# Altium project Second_plate_pic.PrjPcb
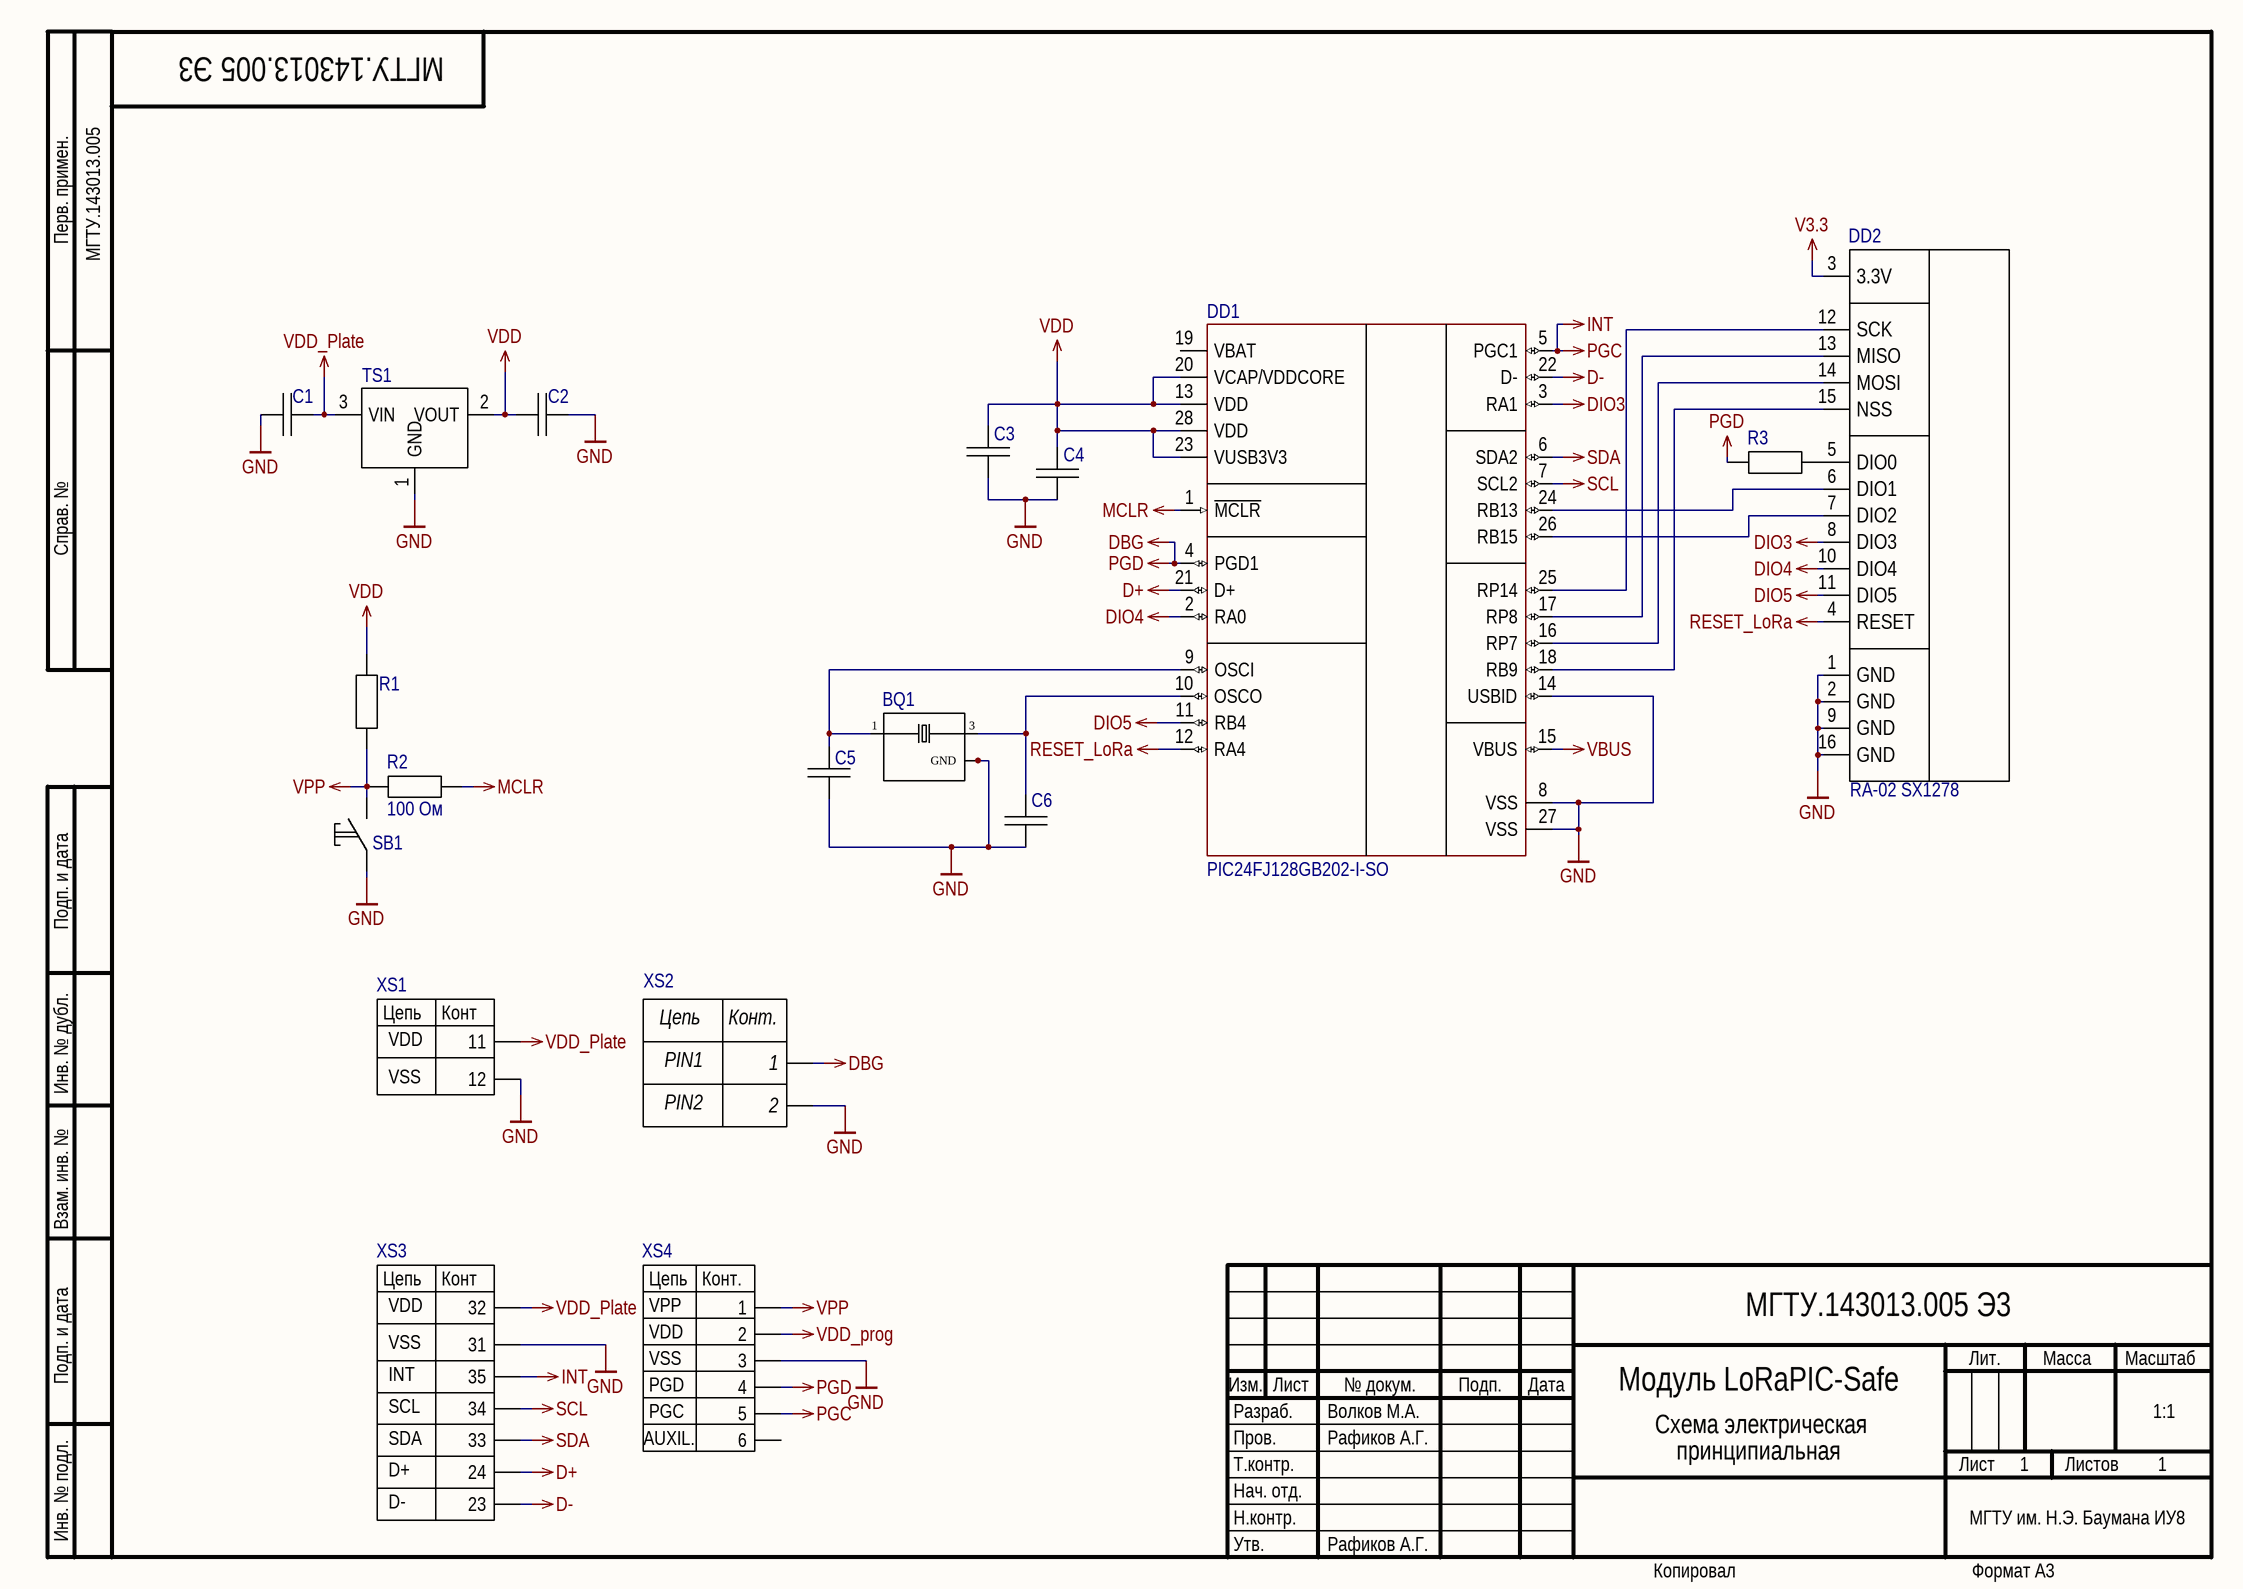
[diagram p0: LoraPic2.SchDoc]
1 sheet, 18 parts. Net scope: global (net labels, ports and power ports of the same name join across sheets).
Board file: LoraPIC2.PcbDoc

## Sheet LoraPic2.SchDoc
size 420 x 297 mm; Organization: Altium Limited; Address1: L3, 12a Rodborough Rd; Address2: Frenchs Forest; Address3: NSW; Address4: Australia 2086; Scale: 1:1; Разраб.: Волков М.А.; Обозначение документа: МГТУ.143013.005 Э3; Пров.: Рафиков А.Г.; Утв.: Рафиков А.Г.; Номер листа: 1; Общее количество листов: 1; Масштаб: 1:1; Наименование организации: МГТУ им. Н.Э. Баумана ИУ8; Перв. применение: МГТУ.143013.005; Наименование изделия 1: Модуль LoRaPIC-Safe; Наименование изделия 2: Схема электрическая; Наименование изделия 3: принципиальная; Нач. отд.: Нач. отд.

### Parts
BQ1  NX2520SA  [*XTAL_NX2520SA-24.000000MHZ-B8]  (value not drawn)
C1  *  [CAPC1608X09L]  (value not drawn)
C2  *  [CAPC1608X09L]  (value not drawn)
C3  *  [CAPC1608X09L]  (value not drawn)
C4  *  [CAPC1608X09L]  (value not drawn)
C5  GRM1885C1H510JA01D  [CAPC1608X09L]  (value not drawn)
C6  GRM1885C2A150JA01D  [CAPC1608X09L]  (value not drawn)
DD1  PIC24FJ128GB202-I-SO  [Microchip_SO-28_0]
DD2  RA-02 SX1278  [RA-02]
R1  RC0603FR-0710KL  [RESC1608X05N]  (value not drawn)
R2  value 100 Ом  [RESC1608X05N]  (hidden comment: 100 ом до 470)
R3  100 ом до 470  [RESC1608X05N]  (value not drawn)
SB1  1437566-3 (FSMSM)  [*SW_1437566-4]  (value not drawn)
TS1  LD1117S33CTR  [*SOT223]  (value not drawn)
XS1  PBS-20  [PBS-20 - 13]  (value not drawn)
XS2  DS1066-02M(MW-2M)  [B2B-XH-A]  (value not drawn)
XS3  PBS-20  [PBS-20]  (value not drawn)
XS4  DS1021-2x3S  [DS1021-2x3S]  (value not drawn)

### Nets
D+: DD1.21(D+) XS3.17(24)
D-: DD1.22(D-) XS3.18(23)
DBG: DD1.4(PGD1) R3.2 XS2.1 XS4.4  [also labelled PGD]
DIO3: DD1.3(RA1) DD2.8(DIO3)
DIO4: DD1.2(RA0) DD2.10(DIO4)
DIO5: DD1.11(RB4) DD2.11(DIO5)
GND: BQ1.2(GND) BQ1.4(GND) C1.2 C2.1 C3.2 C4.2 C5.2 C6.2 DD1.8(VSS) DD1.14(USBID) DD1.27(VSS) DD2.1(GND) DD2.2(GND) DD2.9(GND) DD2.16(GND) SB1.1 TS1.1(GND) XS1.12 XS2.2 XS3.10(31) XS4.3
INT: DD1.5(PGC1) XS3.6(35) XS4.5  [also labelled PGC]
MCLR: DD1.1(~{MCLR}) R2.1
RESET_LoRa: DD1.12(RA4) DD2.4(RESET)
SCL: DD1.7(SCL2) XS3.7(34)
SDA: DD1.6(SDA2) XS3.8(33)
V3.3: DD2.3(3.3V)
VBUS: DD1.15(VBUS)
VDD: C2.2 C3.1 C4.1 DD1.13(VDD) DD1.20(VCAP/VDDCORE) DD1.23(VUSB3V3) DD1.28(VDD) R1.1 TS1.2(VOUT)
VDD_Plate: C1.1 TS1.3(VIN) XS1.11 XS3.9(32)
VDD_prog: XS4.2
VPP: R1.2 R2.2 SB1.2 XS4.1
NetBQ1_1: BQ1.1 C5.1 DD1.9(OSCI)
NetBQ1_3: BQ1.3 C6.1 DD1.10(OSCO)
NetDD1_16: DD1.16(RP7) DD2.14(MOSI)
NetDD1_17: DD1.17(RP8) DD2.13(MISO)
NetDD1_18: DD1.18(RB9) DD2.15(NSS)
NetDD1_24: DD1.24(RB13) DD2.6(DIO1)
NetDD1_25: DD1.25(RP14) DD2.12(SCK)
NetDD1_26: DD1.26(RB15) DD2.7(DIO2)
NetDD2_5: DD2.5(DIO0) R3.1

Not connected (* = marked no-connect by the designer): DD1 19(VBAT); XS4 6

### Notes on the sheet
- Перв. примен.
- Справ. №
- Подп. и дата
- Инв. № дубл.
- Взам. инв. №
- Разраб.
- Изм.
- Лист
- № докум.
- Подп.
- Дата
- Лит.
- Масса
- Масштаб
- Пров.
- Т.контр.
- Листов
- Инв. № подл.
- Утв.
- Н.контр.
- Копировал
- Формат А3
- (in symbol B2B-XH-A) Цепь; Конт.; PIN1; PIN2
- (in symbol PBS-20_1) Цепь; Конт; VDD; VSS
- (in symbol PBS_20_2) Цепь; Конт; VDD; VSS; INT; SCL; SDA; D+; D-
- (in symbol PLD3X2) Цепь; Конт.; VPP; VDD; VSS; PGD; PGC; AUXIL.

### Library data of the parts
BQ1 = NX2520SA-24.000000MHZ-B8: CRYSTAL 24.0000MHZ 10PF SMD; MF: NDK America, Inc.; Package: SMD-4 NDK America, Inc.; MP: NX2520SA-24.000000MHZ-B8; Availability: Unavailable; SnapEDA_Link: https://www.snapeda.com/parts/NX2520SA-24.000000MHZ-B8/NDK%20America%2C%20Inc./view-part/?ref=snap; Price: None; Value: *
C1 = CC1608: Конденсатор 1.6x0.8 мм; Tolerance: ±10%; ТКЕ: X7R; РКД Наименование: CC1608M - NP0 - 16 V - 10 nF ±10%; GRM21BR71C105KA01L: 100n; Voltage: *; Type: *; PartNo: *; Supplier Part Number 1: *; Supplier 1: *
C2 = CC1608: Конденсатор 1.6x0.8 мм; Tolerance: ±10%; ТКЕ: X7R; РКД Наименование: CC1608M - NP0 - 16 V - 10 nF ±10%; GRM21BR71C105KA01L: 10u; Voltage: *; Type: *; PartNo: *; Supplier Part Number 1: *; Supplier 1: *
C3 C4 = CC1608: Конденсатор 1.6x0.8 мм; Tolerance: ±10%; ТКЕ: X7R; РКД Наименование: CC1608M - NP0 - 16 V - 10 nF ±10%; GRM21BR71C105KA01L: 0.1u; Voltage: *; Type: *; PartNo: *; Supplier Part Number 1: *; Supplier 1: *
C5 = CC1608: Конденсатор 1.6x0.8 мм; Tolerance: ±10%; ТКЕ: X7R; РКД Наименование: CC1608M - NP0 - 16 V - 10 nF ±10%; GRM21BR71C105KA01L: 50p; Voltage: *; Type: *; PartNo: *; Supplier Part Number 1: *; Supplier 1: *; ComponentLink1Description: buy; ComponentLink1URL: https://www.chipdip.ru/product/grm1885c1h510j
C6 = CC1608: Конденсатор 0.8x0.5 мм 50 пикофара; Tolerance: ±10%; ТКЕ: X7R; РКД Наименование: CC1608M - NP0 - 16 V - 10 nF ±10%; GRM21BR71C105KA01L: 15p; Voltage: *; Type: *; PartNo: *; Supplier Part Number 1: *; Supplier 1: *; ComponentLink1Description: buy; ComponentLink1URL: https://www.chipdip.ru/product/grm1885c2a150j
DD2 = RA-02
R1 = R1608: Резистор 1.6x0.8 мм; Tolerance: ±5%; РКД Наименование: RC1608M - 100 Ohm ±5%; Value: 10кОм; Type: *; PartNo: *; Supplier 1: *; Supplier Part Number 1: *; ComponentLink1Description: https://www.chipdip.ru/product0/9000079736; ComponentLink1URL: https://www.chipdip.ru/product0/9000079736
R2 = R1608: Резистор 1.6x0.8 мм; Tolerance: ±5%; РКД Наименование: RC1608M - 100 Ohm ±5%; Type: *; PartNo: *; Supplier 1: *; Supplier Part Number 1: *; ComponentLink1Description: https://www.chipdip.ru/product0/9000079616; ComponentLink1URL: https://www.chipdip.ru/product0/9000079616
R3 = R1608: Резистор 1.6x0.8 мм; Tolerance: ±5%; РКД Наименование: RC1608M - 100 Ohm ±5%; Value: 0 Ом; Type: *; PartNo: *; Supplier 1: *; Supplier Part Number 1: *; ComponentLink1Description: https://www.chipdip.ru/product0/9000079616; ComponentLink1URL: https://www.chipdip.ru/product0/9000079616
SB1 = FSMSM: 1437566-3 (FSMSM), Кнопка тактовая h=4.6 мм SMD SPST Switch Tactile / Switch Tactile OFF (ON) SPST Rectangular Button Gull Wing 0.05A 24VDC SMD Loose; Произвдитель: TE Connectivity; Артикул: 1437566-3 (FSMSM); ComponentLink1Description: buy; ComponentLink1URL: https://www.chipdip.ru/product/tyco-1437566-3-fsmsm; ComponentLink2Description: datasheet; ComponentLink2URL: https://static.chipdip.ru/lib/071/DOC000071159.pdf
TS1 = LD1117S33CTR: Linear Regulator / LDO Regulator Pos 3.3V 1.3A 4-Pin(3+Tab) SOT-223 T/R; Code_IPC: SOT-223; PackageVersion: revBB, Aug-2009; PackageReference: SOT-223; PackageDescription: 3-Lead Plastic Small Outline Transistor (TT) [SOT-23]; DatasheetVersion: revB, Feb-2007; PartNumber: LD1117S33CTR; ComponentLink1Description: buy; ComponentLink1URL: https://www.chipdip.ru/product/ld1117s33ctr-2; ComponentLink2Description: datasheet; ComponentLink2URL: https://static.chipdip.ru/lib/292/DOC000292513.pdf
XS1 = PBS-20_1: ComponentLink1Description: datasheet; ComponentLink1URL: https://static.chipdip.ru/lib/226/DOC000226931.pdf; ComponentLink2Description: buy; ComponentLink2URL: https://www.chipdip.ru/catalog-show/pin-connectors-and-sockets?x.698=ZGQ&gq=PBS
XS2 = B2B-XH-A: Разъем 2; Manufacturer: JST; Manufacturer Part Number: B2B-XH-A(LF)(SN); Number of Positions: 2; Connector Type: Male Pin; Contact Resistance: 20mR; Max Current Rating: 3A; Max Voltage Rating (AC): 250V; Insulation Resistance: 1GR; Pitch: 2.5mm; Wire/Cable Gauge: 22AWG; Supplier 1: Digi-Key; Stock 1: 494280; Pricing 1: 1=0.15, 10=0.141, 100=0.0868, 500=0.07182, 1000=0.06284, 5000=0.05387, 10000=0.05237 (USD); Mount: Through Hole; Contact Plating: Copper,Lead,Tin; Colour: Natural; Contact Material: Brass; Housing Material: Polyamide; Housing Colour: White; Min Operating Temperature: -25°C; Max Operating Temperature: 85°C; Termination: Solder; Number of Rows: 1; Packaging: Bulk; Fastening Type: Detent; Orientation: Straight; Current Rating: 3A; Voltage Rating: 250V; Voltage Rating (AC): 250V; Number of Contacts: 2; Max Voltage Rating (DC): 250V; Length: 7.4mm; Depth: 5.75mm; Lead Pitch: 2.5mm; Lead Free: Lead Free; REACH SVHC: No SVHC; Supplier Part Number 1: 455-2247-ND; РКД Наименование: *
XS3 = PBS_20_2
XS4 = PLD3X2: ComponentLink1Description: Datasheet; ComponentLink1URL: https://static.chipdip.ru/lib/227/DOC000227157.pdf; ComponentLink2Description: footprint; ComponentLink2URL: https://www.3dcontentcentral.com/secure/download-model.aspx?catalogid=171&id=227431